# EAGLE schematic SimpleMasterClock (EAGLE 7.7.0)
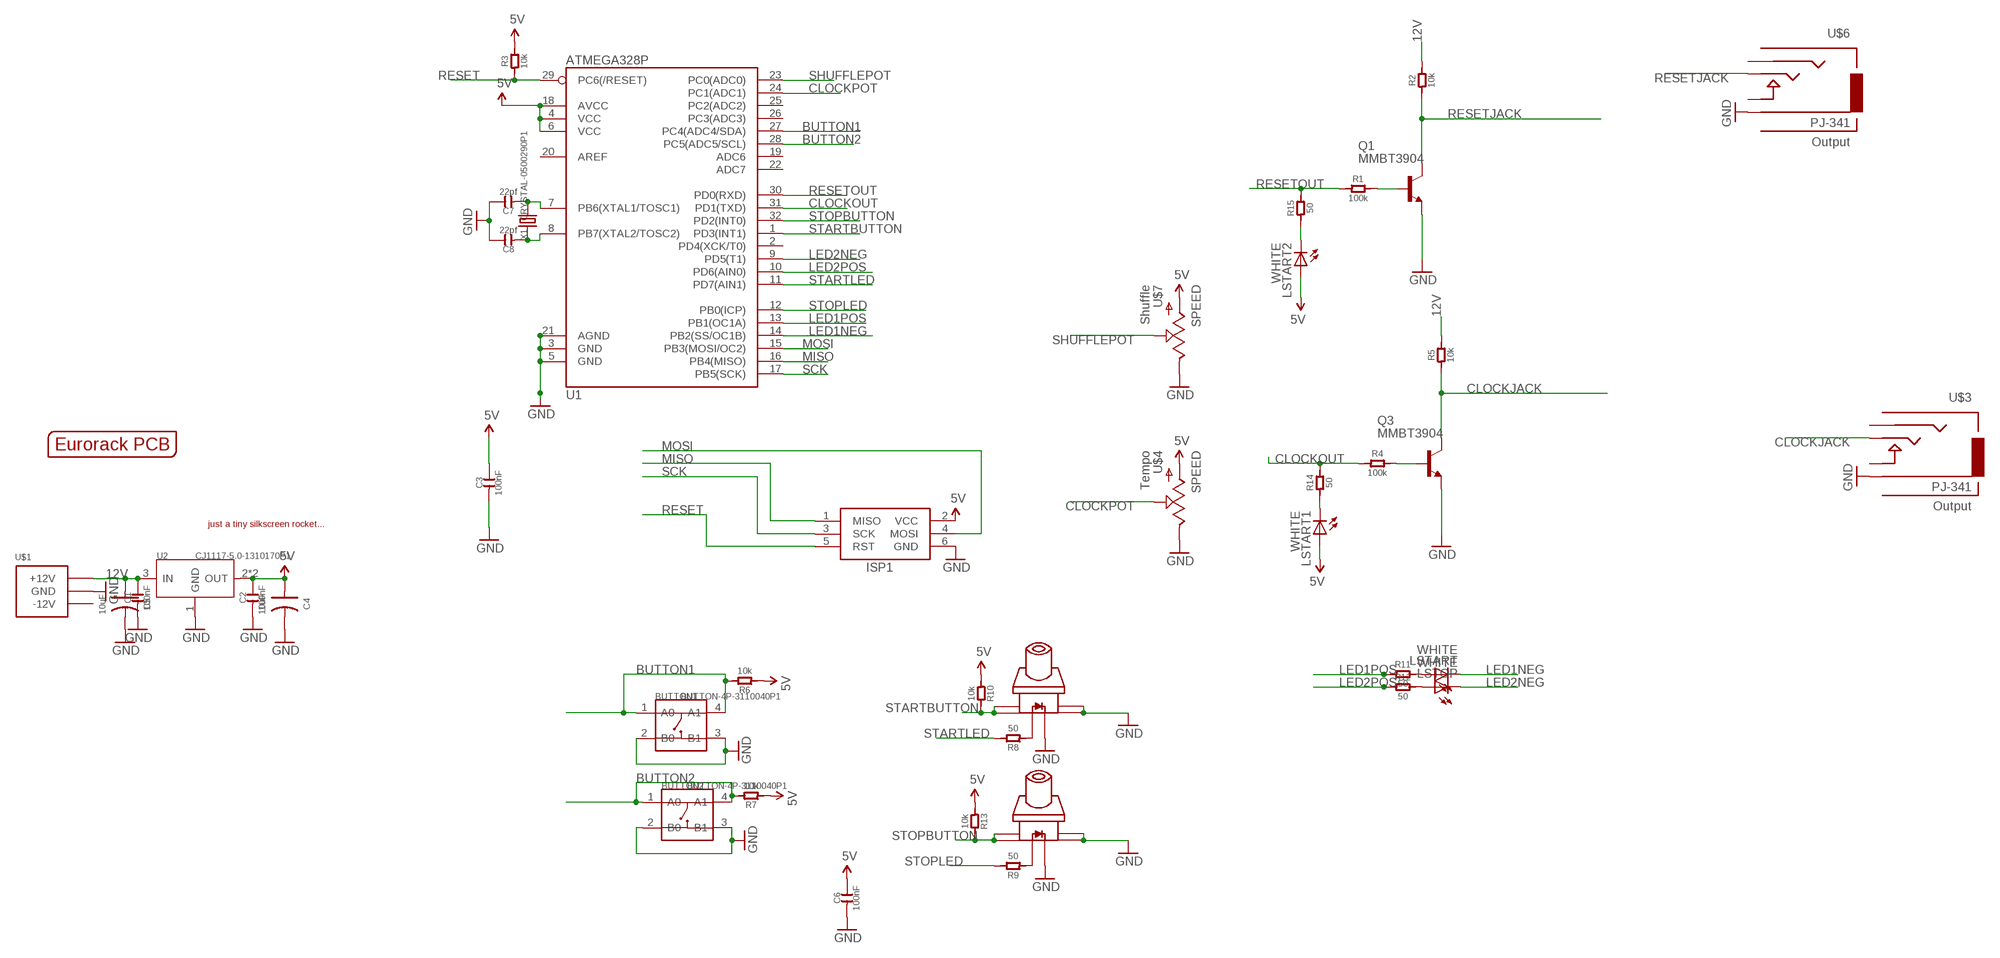
[diagram p0: schematic, sheet 1]

## Parts
BUTTON1  BUTTON-4P-3110040P1  [4P-6.0X6.0X5.0H]
BUTTON2  BUTTON-4P-3110040P1  [4P-6.0X6.0X5.0H]
C1  100nF  C-0603  [C0603]
C2  100nF  C-0603  [C0603]
C3  100nF  C-0603  [C0603]
C4  10uF  C-POLAR-A  [AVX-A]
C5  10uF  C-POLAR-A  [AVX-A]
C6  100nF  C-0603  [C0603]
C7  22pf  C-0603  [C0603]
C8  22pf  C-0603  [C0603]
ISP1  AVRISP-6  [AVRISP]
LSTART  WHITE  LED3MM  [LED3MM]
LSTART1  WHITE  LED3MM  [LED3MM]
LSTART2  WHITE  LED3MM  [LED3MM]
LSTOP  WHITE  LED3MM  [LED3MM]
Q1  MMBT3904  MMBT3904LT1-NPN-SOT23-BEC  [SOT23-BEC]
Q3  MMBT3904  MMBT3904LT1-NPN-SOT23-BEC  [SOT23-BEC]
R1  100k  R-0603  [R0603]
R2  10k  R-0603  [R0603]
R3  10k  R-0603  [R0603]
R4  100k  R-0603  [R0603]
R5  10k  R-0603  [R0603]
R6  10k  R-0603  [R0603]
R7  10k  R-0603  [R0603]
R8  50  R-0603  [R0603]
R9  50  R-0603  [R0603]
R10  10k  R-0603  [R0603]
R11  50  R-0603  [R0603]
R12  50  R-0603  [R0603]
R13  10k  R-0603  [R0603]
R14  50  R-0603  [R0603]
R15  50  R-0603  [R0603]
START  SWITCH_W_LED_PB6149L-X-102WHITE  [PB6149L]
STOP  SWITCH_W_LED_PB6149L-X-102WHITE  [PB6149L]
U1  ATMEGA328P  ATMEGA328_SMT  [TQFP32-08]
U2  CJ1117-5.0-1310170P1  [SOT223]
U$1  POWER_SIMPLE10-OTHERSIDE  [POWER_10_LABELSOTHERSIDE]
U$2  EURORACK_PCB4HP  [EURORACK4HPPCB]
U$3  PJ-341  AUDIO-JACKOUTPUT  [3.5MM-JACK-SWITCH-13MM-OUTPUT]
U$4  SPEED  POTZEPHPOT  [OG-POTS_ALPS_POT_VERTICAL]
U$5  JUSTATINYROCKET  [JUSTATINYROCKET]
U$6  PJ-341  AUDIO-JACKOUTPUT  [3.5MM-JACK-SWITCH-13MM-OUTPUT]
U$7  SPEED  POTZEPHPOT  [OG-POTS_ALPS_POT_VERTICAL]
X1  CRYSTAL-0500290P1  [2P-SMD-5.0X3.2]

## Nets
5V [power]: C2.2 C3.2 C4.+ C6.2 ISP1.2(VCC) LSTART1.A LSTART2.A R3.2 R6.1 R7.1 R10.1 R13.1 U1.4(VCC) U1.6(VCC) U1.18(AVCC) U2.2(OUT) U2.TER(OUT) U$4.P$3(A) U$7.P$3(A)
12V [power]: C1.2 C5.+ R2.2 R5.2 U2.3(IN) U$1.9(+12V) U$1.10(+12V)
BUTTON1: BUTTON1.1(A0) BUTTON1.4(A1) R6.2 U1.27(PC4(ADC4/SDA))
BUTTON2: BUTTON2.1(A0) BUTTON2.4(A1) R7.2 U1.28(PC5(ADC5/SCL))
CLOCKJACK: Q3.C R5.1 U$3.TIP@3(TIP)
CLOCKOUT: R4.1 R14.2 U1.31(PD1(TXD))
CLOCKPOT: U1.24(PC1(ADC1)) U$4.P$2(S)
GND: BUTTON1.2(B0) BUTTON1.3(B1) BUTTON2.2(B0) BUTTON2.3(B1) C1.1 C2.1 C3.1 C4.- C5.- C6.1 C7.2 C8.2 ISP1.6(GND) Q1.E Q3.E START.3 START.4 START.LEDNEG(NEG) STOP.3 STOP.4 STOP.LEDNEG(NEG) U1.3(GND) U1.5(GND) U1.21(AGND) U2.1(GND) U$1.3(GND) U$1.4(GND) U$1.5(GND) U$1.6(GND) U$1.7(GND) U$1.8(GND) U$3.RING@3(RING) U$4.P$1(E) U$6.RING@3(RING) U$7.P$1(E)
LED1NEG: LSTART.K(C) U1.14(PB2(SS/OC1B))
LED1POS: R11.1 U1.13(PB1(OC1A))
LED2NEG: LSTOP.K(C) U1.9(PD5(T1))
LED2POS: R12.1 U1.10(PD6(AIN0))
MISO: ISP1.1(MISO) U1.16(PB4(MISO))
MOSI: ISP1.4(MOSI) U1.15(PB3(MOSI/OC2))
N$1: LSTART.A R11.2
N$2: LSTOP.A R12.2
N$3: R8.1 START.LEDPOS(POS)
N$4: R9.1 STOP.LEDPOS(POS)
N$5: C7.1 U1.7(PB6(XTAL1/TOSC1)) X1.2
N$6: C8.1 U1.8(PB7(XTAL2/TOSC2)) X1.1
N$7: LSTART1.K(C) R14.1
N$8: LSTART2.K(C) R15.1
N$9: Q3.B R4.2
N$12: Q1.B R1.2
RESET: ISP1.5(RST) R3.1 U1.29(PC6(/RESET))
RESETJACK: Q1.C R2.1 U$6.TIP@3(TIP)
RESETOUT: R1.1 R15.2 U1.30(PD0(RXD))
SCK: ISP1.3(SCK) U1.17(PB5(SCK))
SHUFFLEPOT: U1.23(PC0(ADC0)) U$7.P$2(S)
STARTBUTTON: R10.2 START.1 START.2 U1.1(PD3(INT1))
STARTLED: R8.2 U1.11(PD7(AIN1))
STOPBUTTON: R13.2 STOP.1 STOP.2 U1.32(PD2(INT0))
STOPLED: R9.2 U1.12(PB0(ICP))
Unconnected: U1.2(PD4(XCK/T0)) U1.19(ADC6) U1.20(AREF) U1.22(ADC7) U1.25(PC2(ADC2)) U1.26(PC3(ADC3)) U$1.1(-12V) U$1.2(-12V) U$3.SECOND@3(SECOND) U$3.SWITCH@3(SWITCH) U$6.SECOND@3(SECOND) U$6.SWITCH@3(SWITCH)

## Library data of the parts
BUTTON1 BUTTON2 = zephod-components:BUTTON-4P
C1-C3 C6-C8 = OPL:C*
C4 C5 = OPL:C-POLAR*
ISP1 = adafruit:AVRISP: AVR ISP HEADER Standard 6 pin header for AVR programming
LSTART LSTART1 LSTART2 LSTOP = SparkFun-LED:LED: LEDs Standard schematic elements and footprints for 5mm, 3mm, 1206, and 0603 sized LEDs. 5mm - Spark Fun Electronics SKU : COM-00529 (and others)
Q1 Q3 = transistor:*-NPN-: NPN Transistror BF959 corrected 2008.03.06
R1-R15 = OPL:R*
START STOP = zephod-components:SWITCH_W_LED_PB6149L-X-102
U1 = SparkFun-DigitalIC:ATMEGA328_SMT: 32-Pin Atmega328 part Commonly used on Arduino compatible boards Available in QFP and QFN packages TQFP is IC-09069 QFN is non-stock; PROD_ID: IC-09069
U2 = OPL:CJ1117-5.0
U$1 = EurorackModularParts:POWER_SIMPLE
U$2 = EurorackModularParts:EURORACK_PCB
U$3 U$6 = EurorackModularParts:AUDIO-JACK: Switching Mono 3.5mm Audio Jack from Erthenvar.; DESC: Output; MPN: PJ-341
U$4 = EurorackModularParts:POT; DESC: Tempo
U$5 = zephod-components:JUSTATINYROCKET
U$7 = EurorackModularParts:POT; DESC: Shuffle
X1 = OPL:CRYSTAL*

## Net classes
0 default: width 0.203 mm
1 power: width 0.305 mm